# Altium project Controller.PrjPCB
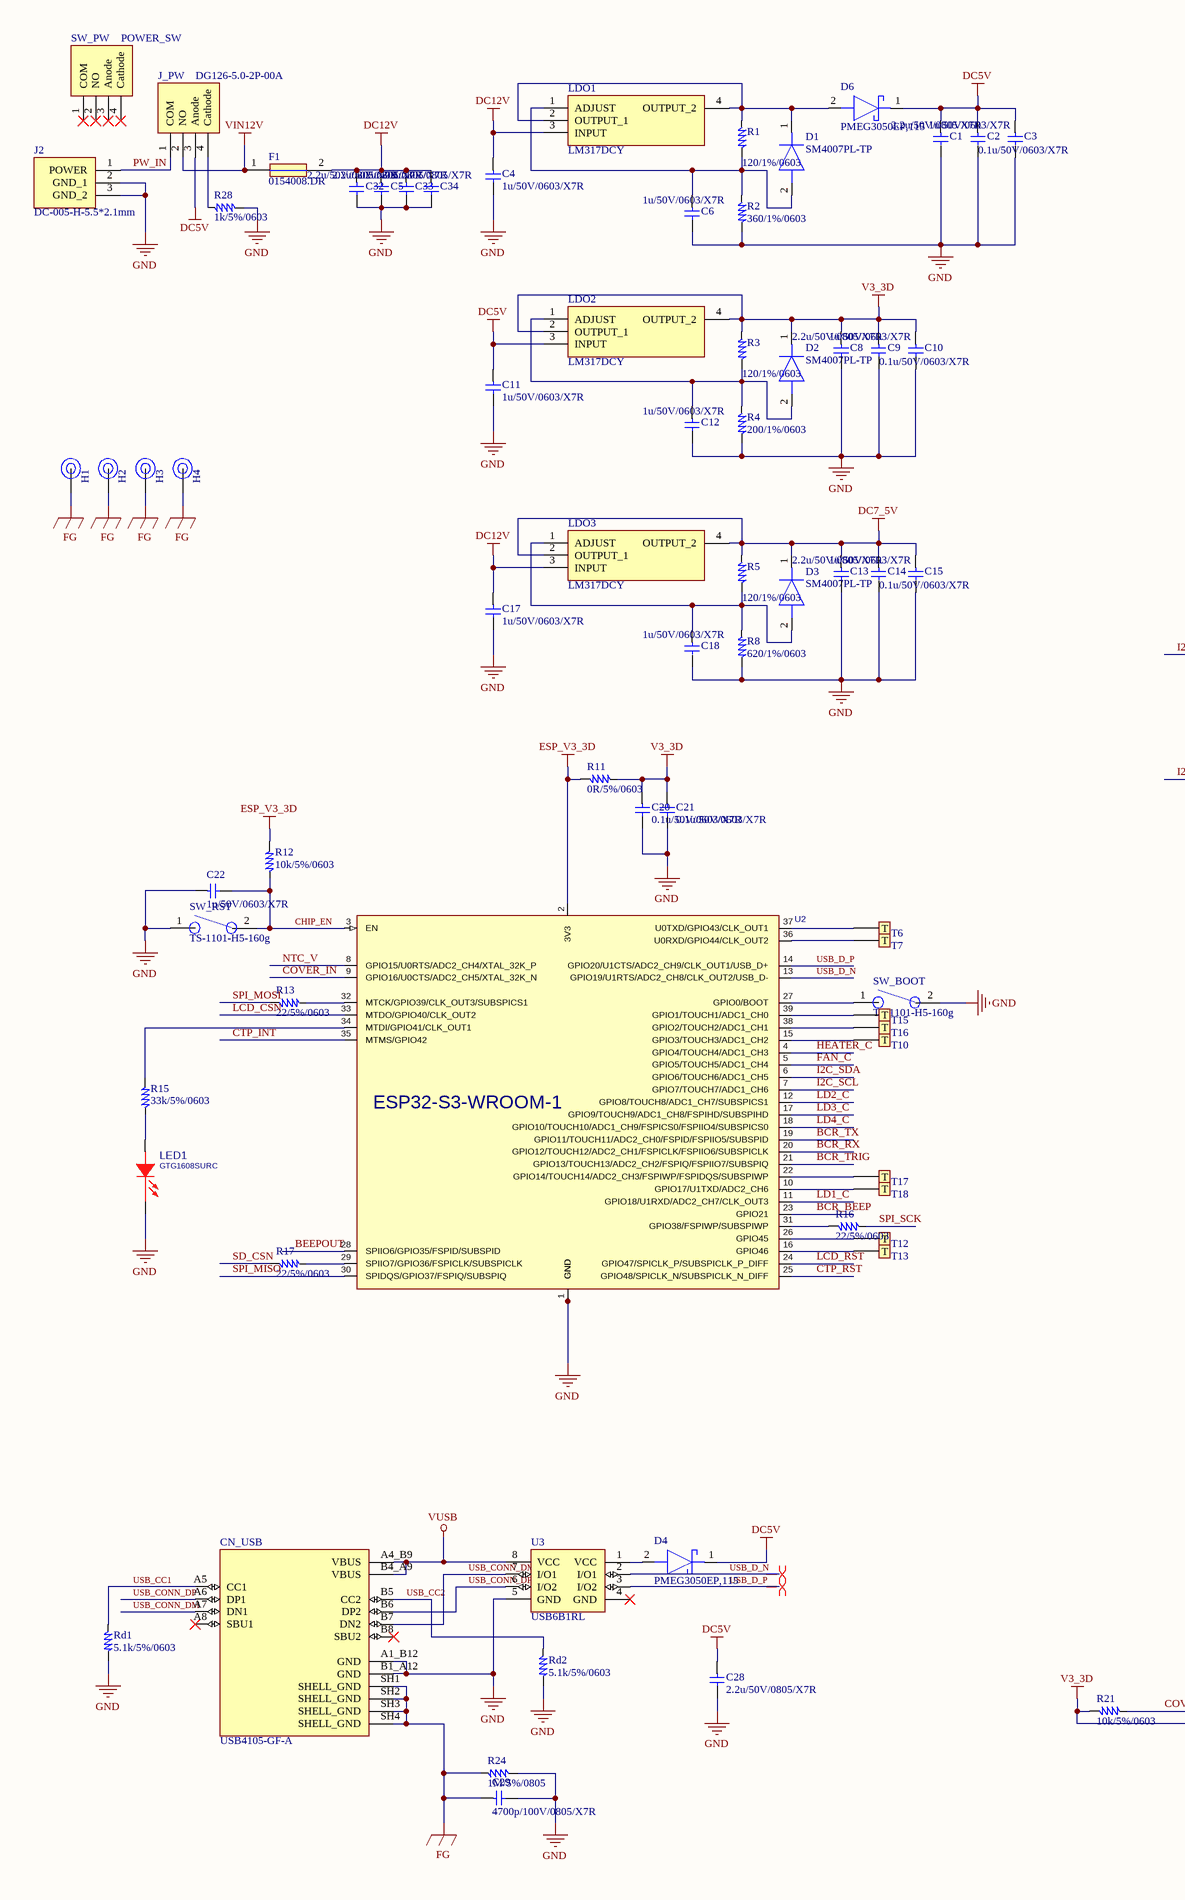
[diagram p0: Controller.SchDoc, left]
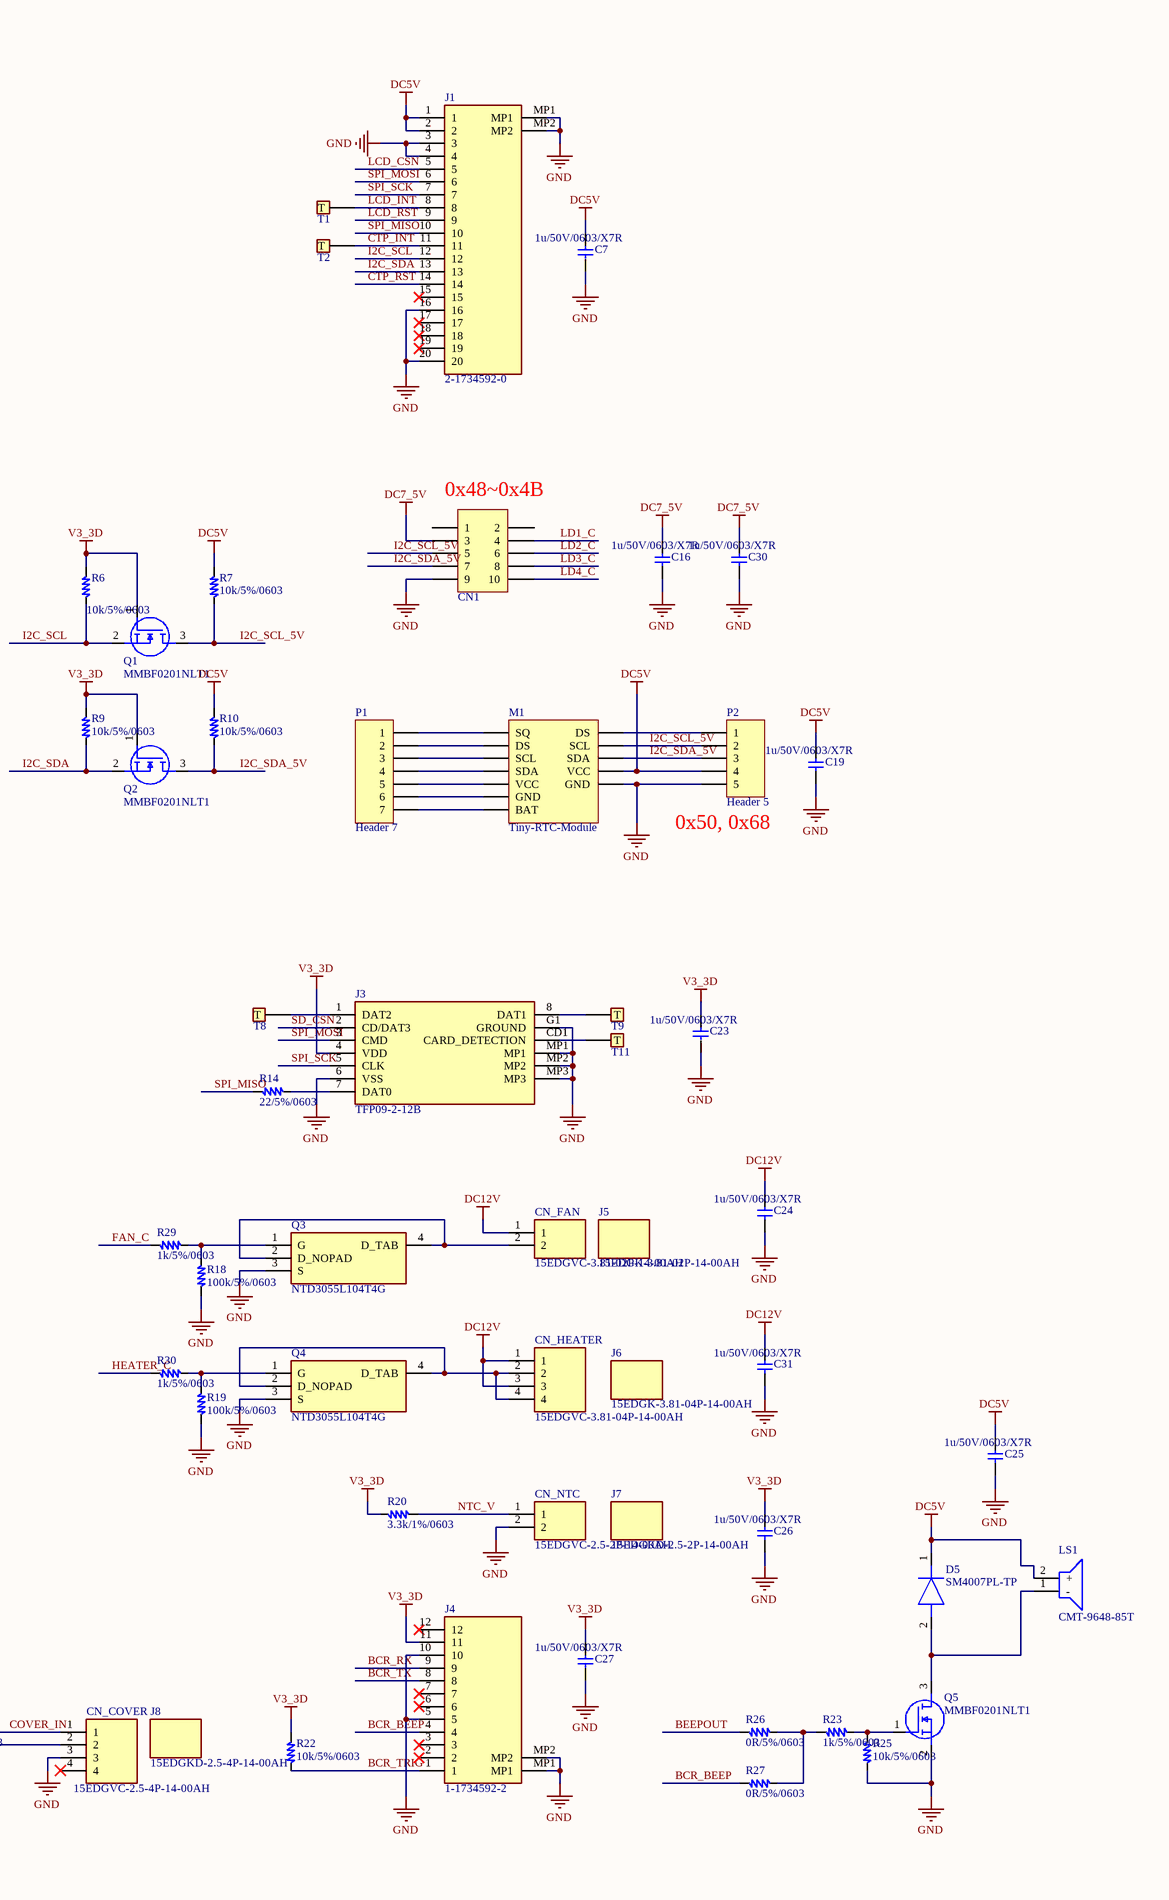
[diagram p1: Controller.SchDoc, right]
1 sheet, 124 parts. Net scope: global (net labels, ports and power ports of the same name join across sheets).
Board file: Controller.PcbDoc

## Sheet Controller.SchDoc
size A2; ENG_APP_DATE: --/--/--; DSN_APP_DATE: --/--/--; CHK_APP_DATE: --/--/--

### Parts
C1  2.2u/50V/0805/X7R  [CC0805]
C2  1u/50V/0603/X7R  [CC0603]
C3  0.1u/50V/0603/X7R  [CC0603]
C4  1u/50V/0603/X7R  [CC0603]
C5  2.2u/50V/0805/X7R  [CC0805]
C6  1u/50V/0603/X7R  [CC0603]
C7  1u/50V/0603/X7R  [CC0603]
C8  2.2u/50V/0805/X7R  [CC0805]
C9  1u/50V/0603/X7R  [CC0603]
C10  0.1u/50V/0603/X7R  [CC0603]
C11  1u/50V/0603/X7R  [CC0603]
C12  1u/50V/0603/X7R  [CC0603]
C13  2.2u/50V/0805/X7R  [CC0805]
C14  1u/50V/0603/X7R  [CC0603]
C15  0.1u/50V/0603/X7R  [CC0603]
C16  1u/50V/0603/X7R  [CC0603]
C17  1u/50V/0603/X7R  [CC0603]
C18  1u/50V/0603/X7R  [CC0603]
C19  1u/50V/0603/X7R  [CC0603]
C20  0.1u/50V/0603/X7R  [CC0603]
C21  0.1u/50V/0603/X7R  [CC0603]
C22  1u/50V/0603/X7R  [CC0603]
C23  1u/50V/0603/X7R  [CC0603]
C24  1u/50V/0603/X7R  [CC0603]
C25  1u/50V/0603/X7R  [CC0603]
C26  1u/50V/0603/X7R  [CC0603]
C27  1u/50V/0603/X7R  [CC0603]
C28  2.2u/50V/0805/X7R  [CC0805]
C29  4700p/100V/0805/X7R  [CC0805]
C30  1u/50V/0603/X7R  [CC0603]
C31  1u/50V/0603/X7R  [CC0603]
C32  2.2u/50V/0805/X7R  [CC0805]
C33  2.2u/50V/0805/X7R  [CC0805]
C34  2.2u/50V/0805/X7R  [CC0805]
CN1  320-10  [SHDR10W70P254_2X5_2000X850X900P]  (value not drawn)
CN_COVER  15EDGVC-2.5-4P-14-00AH  [15EDGVC-2.5-4P-14-00AH]
CN_FAN  15EDGVC-3.81-02P-14-00AH  [15EDGVC-3.81-02P-14-00AH]
CN_HEATER  15EDGVC-3.81-04P-14-00AH  [15EDGVC-3.81-04P-14-00AH]
CN_NTC  15EDGVC-2.5-2P-14-00AH  [15EDGVC-2.5-2P-14-00AH]
CN_USB  USB4105-GF-A  [USB4105-GF-A]
D1  SM4007PL-TP  [SM4007PLTP]
D2  SM4007PL-TP  [SM4007PLTP]
D3  SM4007PL-TP  [SM4007PLTP]
D4  PMEG3050EP,115  [PMEG3050EP115]
D5  SM4007PL-TP  [SM4007PLTP]
D6  PMEG3050EP,115  [PMEG3050EP115]
F1  0154008.DR  [0154001.DRT]
H1  Screw_holes_3p5mm  [Screw_holes_3p5mm]  (value not drawn)  (no BOM)
H2  Screw_holes_3p5mm  [Screw_holes_3p5mm]  (value not drawn)  (no BOM)
H3  Screw_holes_3p5mm  [Screw_holes_3p5mm]  (value not drawn)  (no BOM)
H4  Screw_holes_3p5mm  [Screw_holes_3p5mm]  (value not drawn)  (no BOM)
J1  2-1734592-0  [217345920]
J2  DC-005-H-5.5*2.1mm  [DC-005-H-5.5*2.1mm]
J3  TFP09-2-12B  [TFP09212B]
J4  1-1734592-2  [117345922]
J5  15EDGK-3.81-02P-14-00AH  [15EDGK-3.81-02P-14-00AH]
J6  15EDGK-3.81-04P-14-00AH  [15EDGK-3.81-04P-14-00AH]
J7  15EDGKD-2.5-2P-14-00AH  [15EDGKD-2.5-2P-14-00AH]
J8  15EDGKD-2.5-4P-14-00AH  [15EDGKD-2.5-4P-14-00AH]
J_PW  DG126-5.0-2P-00A  [DG126-5.0-2P-00A_PW_SW]
LDO1  LM317DCY  [SOT230P700X180-4N]
LDO2  LM317DCY  [SOT230P700X180-4N]
LDO3  LM317DCY  [SOT230P700X180-4N]
LED1  GTG1608SURC  [LED0603_RED]
LS1  CMT-9648-85T  [CMT964885T]
M1  Tiny-RTC-Module  [TINY RTC I2C Module]
P1  Header 7  [HDR1X7_2.54_ST_H8.54]
P2  Header 5  [HDR1X5_2.54_ST_H8.54]
Q1  MMBF0201NLT1  [SOT65P210X110-3N]
Q2  MMBF0201NLT1  [SOT65P210X110-3N]
Q3  NTD3055L104T4G  [TO229P990X238-4N]
Q4  NTD3055L104T4G  [TO229P990X238-4N]
Q5  MMBF0201NLT1  [SOT65P210X110-3N]
R1  120/1%/0603  [CC0603_R]
R2  360/1%/0603  [CC0603_R]
R3  120/1%/0603  [CC0603_R]
R4  200/1%/0603  [CC0603_R]
R5  120/1%/0603  [CC0603_R]
R6  10k/5%/0603  [CC0603_R]
R7  10k/5%/0603  [CC0603_R]
R8  620/1%/0603  [CC0603_R]
R9  10k/5%/0603  [CC0603_R]
R10  10k/5%/0603  [CC0603_R]
R11  0R/5%/0603  [CC0603_R]
R12  10k/5%/0603  [CC0603_R]
R13  22/5%/0603  [CC0603_R]
R14  22/5%/0603  [CC0603_R]
R15  33k/5%/0603  [CC0603_R]
R16  22/5%/0603  [CC0603_R]
R17  22/5%/0603  [CC0603_R]
R18  100k/5%/0603  [CC0603_R]
R19  100k/5%/0603  [CC0603_R]
R20  3.3k/1%/0603  [CC0603_R]
R21  10k/5%/0603  [CC0603_R]
R22  10k/5%/0603  [CC0603_R]
R23  1k/5%/0603  [CC0603_R]
R24  1M/5%/0805  [CC0805_R]
R25  10k/5%/0603  [CC0603_R]
R26  0R/5%/0603  [CC0603_R]
R27  0R/5%/0603  [CC0603_R]
R28  1k/5%/0603  [CC0603_R]
R29  1k/5%/0603  [CC0603_R]
R30  1k/5%/0603  [CC0603_R]
Rd1  5.1k/5%/0603  [CC0603_R]
Rd2  5.1k/5%/0603  [CC0603_R]
SW_BOOT  TS-1101-H5-160g  [TS-1101-H5-160g]
SW_PW  POWER_SW  [POWER_SW]
SW_RST  TS-1101-H5-160g  [TS-1101-H5-160g]
T1  Test_Pad  [Test_Pad_40mil]  (value not drawn)  (no BOM)
T2  Test_Pad  [Test_Pad_40mil]  (value not drawn)  (no BOM)
T6  Test_Pad  [Test_Pad_40mil]  (value not drawn)  (no BOM)
T7  Test_Pad  [Test_Pad_40mil]  (value not drawn)  (no BOM)
T8  Test_Pad  [Test_Pad_40mil]  (value not drawn)  (no BOM)
T9  Test_Pad  [Test_Pad_40mil]  (value not drawn)  (no BOM)
T10  Test_Pad  [Test_Pad_40mil]  (value not drawn)  (no BOM)
T11  Test_Pad  [Test_Pad_40mil]  (value not drawn)  (no BOM)
T12  Test_Pad  [Test_Pad_40mil]  (value not drawn)  (no BOM)
T13  Test_Pad  [Test_Pad_40mil]  (value not drawn)  (no BOM)
T15  Test_Pad  [Test_Pad_40mil]  (value not drawn)  (no BOM)
T16  Test_Pad  [Test_Pad_40mil]  (value not drawn)  (no BOM)
T17  Test_Pad  [Test_Pad_40mil]  (value not drawn)  (no BOM)
T18  Test_Pad  [Test_Pad_40mil]  (value not drawn)  (no BOM)
U2  ESP32-S3-WROOM-1-N8R2  [ESP32S3WROOM1N8R2]  (value not drawn)
U3  USB6B1RL  [SOIC127P600X175-8N]

### Nets
DC5V: C1.1 C2.1 C3.1 C7.1 C11.1 C19.1 C25.1 C28.1 D4.1(K) D5.1(K) D6.1(K) J1.1 J1.2 J_PW.3(Anode) LDO2.3(INPUT) LS1.2(+) M1.9(VCC) P2.4 R7.2 R10.2
DC7_5V: C13.1 C14.1 C15.1 C16.1 C30.1 CN1.3 D3.1(K) LDO3.2(OUTPUT_1) LDO3.4(OUTPUT_2) R5.1
DC12V: C4.1 C5.1 C17.1 C24.1 C31.1 C32.1 C33.1 C34.1 CN_FAN.1 CN_HEATER.1 CN_HEATER.3 F1.2 LDO1.3(INPUT) LDO3.3(INPUT)
ESP_V3_3D: R11.2 R12.2 U2.2(3V3)
FG: C29.1 CN_USB.SH1(SHELL_GND) CN_USB.SH2(SHELL_GND) CN_USB.SH3(SHELL_GND) CN_USB.SH4(SHELL_GND) H1.1 H2.1 H3.1 H4.1 R24.1
GND: C1.2 C2.2 C3.2 C4.2 C5.2 C6.2 C7.2 C8.2 C9.2 C10.2 C11.2 C12.2 C13.2 C14.2 C15.2 C16.2 C17.2 C18.2 C19.2 C20.2 C21.2 C22.1 C23.2 C24.2 C25.2 C26.2 C27.2 C28.2 C29.2 C30.2 C31.2 C32.2 C33.2 C34.2 CN1.9 CN_COVER.3 CN_NTC.2 CN_USB.A1_B12(GND) CN_USB.B1_A12(GND) J1.3 J1.4 J1.16 J1.20 J1.MP1 J1.MP2 J2.2(GND_1) J2.3(GND_2) J3.6(VSS) J3.G1(GROUND) J3.MP1 J3.MP2 J3.MP3 J4.5 J4.10 J4.MP1 J4.MP2 LED1.1(CATHODE) M1.8(GND) P2.5 Q3.3(S) Q4.3(S) Q5.2(S) R2.2 R4.2 R8.2 R18.2 R19.2 R24.2 R25.1 R28.2 Rd1.2 Rd2.2 SW_BOOT.2(NO_1) SW_RST.1(COM_1) U2.1(GND) U2.40(GND) U2.41(GND) U3.5(GND)
V3_3D: C8.1 C9.1 C10.1 C20.1 C21.1 C23.1 C26.1 C27.1 CN_COVER.2 D2.1(K) J3.4(VDD) J4.11 LDO2.2(OUTPUT_1) LDO2.4(OUTPUT_2) Q1.1(G) Q2.1(G) R3.1 R6.2 R9.2 R11.1 R20.1 R21.2 R22.2
VIN12V: F1.1 J_PW.2(NO)
VUSB: CN_USB.A4_B9(VBUS) CN_USB.B4_A9(VBUS) U3.8(VCC)
BCR_BEEP: J4.4 R27.2 U2.23(GPIO21)
BCR_RX: J4.9 U2.20(GPIO12/TOUCH12/ADC2_CH1/FSPICLK/FSPIIO6/SUBSPICLK)
BCR_TRIG: J4.1 R22.1 U2.21(GPIO13/TOUCH13/ADC2_CH2/FSPIQ/FSPIIO7/SUBSPIQ)
BCR_TX: J4.8 U2.19(GPIO11/TOUCH11/ADC2_CH0/FSPID/FSPIIO5/SUBSPID)
BEEPOUT: R26.2 U2.28(SPIIO6/GPIO35/FSPID/SUBSPID)
CHIP_EN: C22.2 R12.1 SW_RST.2(NO_1) U2.3(EN)
COVER_IN: CN_COVER.1 R21.1 U2.9(GPIO16/U0CTS/ADC2_CH5/XTAL_32K_N)
CTP_INT: J1.11 T2.1(T) U2.35(MTMS/GPIO42)
CTP_RST: J1.14 U2.25(GPIO48/SPICLK_N/SUBSPICLK_N_DIFF)
FAN_C: R29.2 U2.5(GPIO5/TOUCH5/ADC1_CH4)
HEATER_C: R30.2 U2.4(GPIO4/TOUCH4/ADC1_CH3)
I2C_SCL: J1.12 Q1.2(S) R6.1 U2.7(GPIO7/TOUCH7/ADC1_CH6)
I2C_SCL_5V: CN1.5 M1.11(SCL) P2.2 Q1.3(D) R7.1
I2C_SDA: J1.13 Q2.2(S) R9.1 U2.6(GPIO6/TOUCH6/ADC1_CH5)
I2C_SDA_5V: CN1.7 M1.10(SDA) P2.3 Q2.3(D) R10.1
LCD_CSN: J1.5 U2.33(MTDO/GPIO40/CLK_OUT2)
LCD_INT: J1.8 T1.1(T)
LCD_RST: J1.9 U2.24(GPIO47/SPICLK_P/SUBSPICLK_P_DIFF)
LD1_C: CN1.4 U2.11(GPIO18/U1RXD/ADC2_CH7/CLK_OUT3)
LD2_C: CN1.6 U2.12(GPIO8/TOUCH8/ADC1_CH7/SUBSPICS1)
LD3_C: CN1.8 U2.17(GPIO9/TOUCH9/ADC1_CH8/FSPIHD/SUBSPIHD)
LD4_C: CN1.10 U2.18(GPIO10/TOUCH10/ADC1_CH9/FSPICS0/FSPIIO4/SUBSPICS0)
NTC_V: CN_NTC.1 R20.2 U2.8(GPIO15/U0RTS/ADC2_CH4/XTAL_32K_P)
PW_IN: J2.1(POWER) J_PW.1(COM)
SD_CSN: J3.2(CD/DAT3) R17.2
SPI_MISO: J1.10 R14.2 U2.30(SPIDQS/GPIO37/FSPIQ/SUBSPIQ)
SPI_MOSI: J1.6 J3.3(CMD) R13.2
SPI_SCK: J1.7 J3.5(CLK) R16.1
USB_CC1: CN_USB.A5(CC1) Rd1.1
USB_CC2: CN_USB.B5(CC2) Rd2.1
USB_CONN_DM: CN_USB.A7(DN1) CN_USB.B7(DN2) U3.7(I/O1)
USB_CONN_DP: CN_USB.A6(DP1) CN_USB.B6(DP2) U3.6(I/O2)
USB_D_N: U2.13(GPIO19/U1RTS/ADC2_CH8/CLK_OUT2/USB_D-) U3.2(I/O1)
USB_D_P: U2.14(GPIO20/U1CTS/ADC2_CH9/CLK_OUT1/USB_D+) U3.3(I/O2)
NetC6_1: C6.1 D1.2(A) LDO1.1(ADJUST) R1.2 R2.1
NetC12_1: C12.1 D2.2(A) LDO2.1(ADJUST) R3.2 R4.1
NetC18_1: C18.1 D3.2(A) LDO3.1(ADJUST) R5.2 R8.1
NetCN_FAN_2: CN_FAN.2 Q3.2(D_NOPAD) Q3.4(D_TAB)
NetCN_HEATER_2: CN_HEATER.2 CN_HEATER.4 Q4.2(D_NOPAD) Q4.4(D_TAB)
NetD1_1: D1.1(K) D6.2(A) LDO1.2(OUTPUT_1) LDO1.4(OUTPUT_2) R1.1
NetD4_2: D4.2(A) U3.1(VCC)
NetD5_2: D5.2(A) LS1.1(-) Q5.3(D)
NetJ3_1: J3.1(DAT2) T8.1(T)
NetJ3_7: J3.7(DAT0) R14.1
NetJ3_8: J3.8(DAT1) T9.1(T)
NetJ3_CD1: J3.CD1(CARD_DETECTION) T11.1(T)
NetJ_PW_4: J_PW.4(Cathode) R28.1
NetLED1_2: LED1.2(ANODE) R15.1
NetM1_1: M1.1(SQ) P1.1
NetM1_2: M1.2(DS) P1.2
NetM1_3: M1.3(SCL) P1.3
NetM1_4: M1.4(SDA) P1.4
NetM1_5: M1.5(VCC) P1.5
NetM1_6: M1.6(GND) P1.6
NetM1_7: M1.7(BAT) P1.7
NetM1_12: M1.12(DS) P2.1
NetQ3_1: Q3.1(G) R18.1 R29.1
NetQ4_1: Q4.1(G) R19.1 R30.1
NetQ5_1: Q5.1(G) R23.1 R25.2
NetR13_1: R13.1 U2.32(MTCK/GPIO39/CLK_OUT3/SUBSPICS1)
NetR15_2: R15.2 U2.34(MTDI/GPIO41/CLK_OUT1)
NetR16_2: R16.2 U2.31(GPIO38/FSPIWP/SUBSPIWP)
NetR17_1: R17.1 U2.29(SPIIO7/GPIO36/FSPICLK/SUBSPICLK)
NetR23_2: R23.2 R26.1 R27.1
NetSW_BOOT_1: SW_BOOT.1(COM_1) U2.27(GPIO0/BOOT)
NetT6_1: T6.1(T) U2.37(U0TXD/GPIO43/CLK_OUT1)
NetT7_1: T7.1(T) U2.36(U0RXD/GPIO44/CLK_OUT2)
NetT10_1: T10.1(T) U2.15(GPIO3/TOUCH3/ADC1_CH2)
NetT12_1: T12.1(T) U2.26(GPIO45)
NetT13_1: T13.1(T) U2.16(GPIO46)
NetT15_1: T15.1(T) U2.39(GPIO1/TOUCH1/ADC1_CH0)
NetT16_1: T16.1(T) U2.38(GPIO2/TOUCH2/ADC1_CH1)
NetT17_1: T17.1(T) U2.22(GPIO14/TOUCH14/ADC2_CH3/FSPIWP/FSPIDQS/SUBSPIWP)
NetT18_1: T18.1(T) U2.10(GPIO17/U1TXD/ADC2_CH6)

Not connected (* = marked no-connect by the designer): CN1 1 2; CN_COVER 4*; CN_USB A8(SBU1)* B8(SBU2)*; J1 15* 17* 18* 19*; J4 2* 3* 6* 7* 12*; SW_PW 1(COM)* 2(NO)* 3(Anode)* 4(Cathode)*; U3 4(GND)*

### Layout directives
differential pair: USB_D_N, USB_D_P

### Notes on the sheet
- (near CN1) 0x48~0x4B
- (near P2) 0x50, 0x68

### Library data of the parts
C1-C34 = CAP_MLCC
CN1 = 320-10: IDC_(100y) VER TH 10POS 2.54MM
CN_COVER = 15EDGVC-2.5-4P-14-00AH: 端子台(百年)
CN_FAN = 15EDGVC-3.81-02P-14-00AH: 端子台(百年)
CN_HEATER = 15EDGVC-3.81-04P-14-00AH: 端子台(百年)
CN_NTC = 15EDGVC-2.5-2P-14-00AH: 端子台(百年)
CN_USB = USB4105-GF-A: USB_Type-C (USB2.0) 24P(16+8 Dummy)  SMD RA
D1-D3 D5 = SM4007PL-TP: 整流器 1A, 1000V 1A, 1000V
D4 D6 = PMEG3050EP,115: Schottky_RECT 30V 5A VF 0.315V
F1 = 0154008.DR: Fuse
H1-H4 = Screw_holes: Screw holes
J1 = 2-1734592-0: FFC和FPC連接器 0.5mm PITCH B/C 20P
J2 = DC-005-H-5.5*2.1mm: DC-005-H-5.5*2.1mm(百年)
J3 = TFP09-2-12B: Micro SD Card Connector(百年)
J4 = 1-1734592-2: FFC和FPC連接器 0.5mm PITCH B/C 12P
J5 = 15EDGK-3.81-02P-14-00AH: 端子接頭(百年)
J6 = 15EDGK-3.81-04P-14-00AH: 端子接頭(百年)
J7 = 15EDGKD-2.5-2P-14-00AH: 端子接頭(百年)
J8 = 15EDGKD-2.5-4P-14-00AH: 端子接頭(百年)
J_PW = DG126-5.0-2P-00A_SW: 端子台
LDO1-LDO3 = LM317DCY: 線性電壓穩壓器 3 T 1.5A Adj Pos V
LED1 = GTG1608SURC: LED0603_RED(百年)
LS1 = CMT-9648-85T: Loudspeaker or Buzzer
M1 = Tiny-RTC-Module: DS1307 RTC Module / (百年)100698
P1 = Header 7: D15-40P/全長-14.2MM(百年)
P2 = Header 5: D15-40P/全長-14.2MM(百年)
Q1 Q2 Q5 = MMBF0201NLT1: MOSFET (N-Channel)(百年)
Q3 Q4 = NTD3055L104T4G: MOSFET 60V 12A N-Channel
R1-R30 Rd1 Rd2 = RES_SMD: RES_
SW_BOOT SW_RST = TS-1101-H5-160g: Switch_Tact Switch / TS-1101-H5-160g(百年)
SW_PW = POWER_SW: 帶燈Switch
U2 = ESP32-S3-WROOM-1: MCU_ESP32-S3 8M Flash 2MB SRAM with PCB Antenan
U3 = USB6B1RL: TVS_6V 25A/ ESD_2-Channel +/-8kV

## Assembly variants
V0: not fitted R24 R? R? R? R? R? SW_BOOT